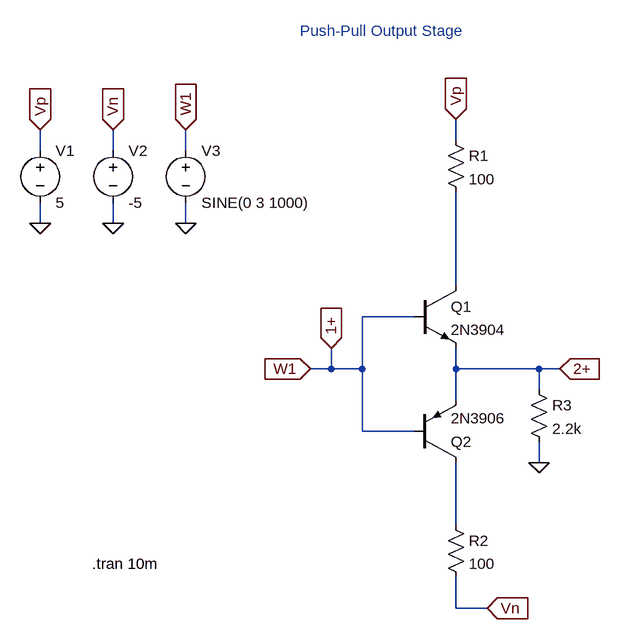
[diagram p0: schematic pp_out_stage_ltspice.asc]
pp_out_stage_ltspice.asc, the LTspice schematic file:
Version 4
SHEET 1 880 716
WIRE 160 -96 160 -128
WIRE -480 -80 -480 -112
WIRE -368 -80 -368 -112
WIRE -256 -80 -256 -112
WIRE -480 32 -480 0
WIRE -368 32 -368 0
WIRE -256 32 -256 0
WIRE 160 128 160 -16
WIRE 96 176 16 176
WIRE -32 256 -32 224
WIRE -32 256 -64 256
WIRE 16 256 16 176
WIRE 16 256 -32 256
WIRE 160 256 160 224
WIRE 288 256 160 256
WIRE 320 256 288 256
WIRE 288 288 288 256
WIRE 160 304 160 256
WIRE 16 352 16 256
WIRE 96 352 16 352
WIRE 288 400 288 368
WIRE 160 496 160 400
WIRE 160 624 160 576
WIRE 208 624 160 624
FLAG 160 -128 Vp
IOPIN 160 -128 In
FLAG 320 256 2+
IOPIN 320 256 In
FLAG -32 224 1+
IOPIN -32 224 In
FLAG -64 256 W1
IOPIN -64 256 In
FLAG 208 624 Vn
IOPIN 208 624 In
FLAG 288 400 0
FLAG -480 32 0
FLAG -368 32 0
FLAG -256 32 0
FLAG -480 -112 Vp
IOPIN -480 -112 In
FLAG -368 -112 Vn
IOPIN -368 -112 In
FLAG -256 -112 W1
IOPIN -256 -112 In
SYMBOL npn 96 128 R0
SYMATTR InstName Q1
SYMATTR Value 2N3904
SYMBOL pnp 96 400 M180
SYMATTR InstName Q2
SYMATTR Value 2N3906
SYMBOL res 144 -112 R0
SYMATTR InstName R1
SYMATTR Value 100
SYMBOL res 144 480 R0
SYMATTR InstName R2
SYMATTR Value 100
SYMBOL res 272 272 R0
SYMATTR InstName R3
SYMATTR Value 2.2k
SYMBOL voltage -480 -96 R0
WINDOW 123 0 0 Left 0
WINDOW 39 0 0 Left 0
SYMATTR InstName V1
SYMATTR Value 5
SYMBOL voltage -368 -96 R0
WINDOW 123 0 0 Left 0
WINDOW 39 0 0 Left 0
SYMATTR InstName V2
SYMATTR Value -5
SYMBOL voltage -256 -96 R0
WINDOW 123 0 0 Left 0
WINDOW 39 0 0 Left 0
SYMATTR InstName V3
SYMATTR Value SINE(0 3 1000)
TEXT -400 556 Left 2 !.tran 10m
TEXT -80 -264 Left 2 ;Push-Pull Output Stage

The netlist it stands for:
* pp_out_stage_ltspice.asc
Q1 N001 W1 2+ 0 2N3904
Q2 N002 W1 2+ 0 2N3906
R1 Vp N001 100
R2 N002 Vn 100
R3 2+ 0 2.2k
V1 Vp 0 5
V2 Vn 0 -5
V3 W1 0 SINE(0 3 1000)
.model NPN NPN
.model PNP PNP
.lib standard.bjt
.tran 10m
* Push-Pull Output Stage
.backanno
.end